# Altium schematic sheet GateAndFanControl.SchDoc
size A4; Organization: UltraZohm; DocumentNumber: 5; SheetNumber: 9; SheetTotal: 11; Website: www.ultrazohm.com
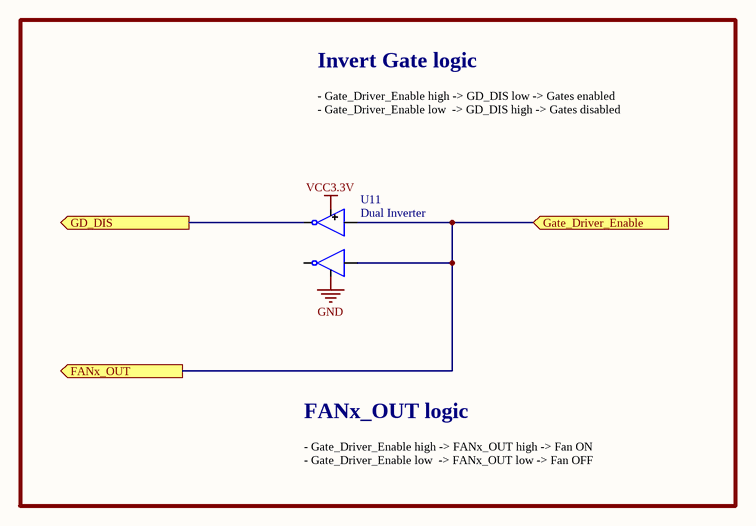
[diagram p0: GateAndFanControl.SchDoc]

## Parts
U11  Dual Inverter  [SN74LVC2GU04DCKR]

## Ports
FANx_OUT (out, see TopSheet[1D]), Gate_Driver_Enable (in, see TopSheet[1D], OvercurrentDetectionLogic[3A]), GD_DIS (out, see TopSheet[1D], Connector_Inverter[2C])

## Nets
GND: U11.2(GND)
VCC3.3V: U11.5(VCC)
FANx_OUT: U11.1(IN1) U11.3(IN2) ; port Gate_Driver_Enable, port FANx_OUT
GD_DIS: U11.6(OUT2) ; port GD_DIS

Not connected (* = marked no-connect by the designer): U11 4(OUT2)

## Notes on the sheet
- Invert Gate logic
- - Gate_Driver_Enable high -> GD_DIS low -> Gates enabled
  - Gate_Driver_Enable low  -> GD_DIS high -> Gates disabled
- FANx_OUT logic
- - Gate_Driver_Enable high -> FANx_OUT high -> Fan ON
  - Gate_Driver_Enable low  -> FANx_OUT low -> Fan OFF
- Title
- Revision:
- Design Engineer:
- Date:
- Project:
- Sheet
- of

## Library data of the parts
U11 = SN74LVC2GU04DCKR: This dual inverter is designed for 1.65-V to 5.5-V VCC / operation.; JLCSMT Rotation: 180; LCSC Part Number: C116660